# EAGLE design LaunchPad_CarrierV2 (EAGLE 7.1.0)
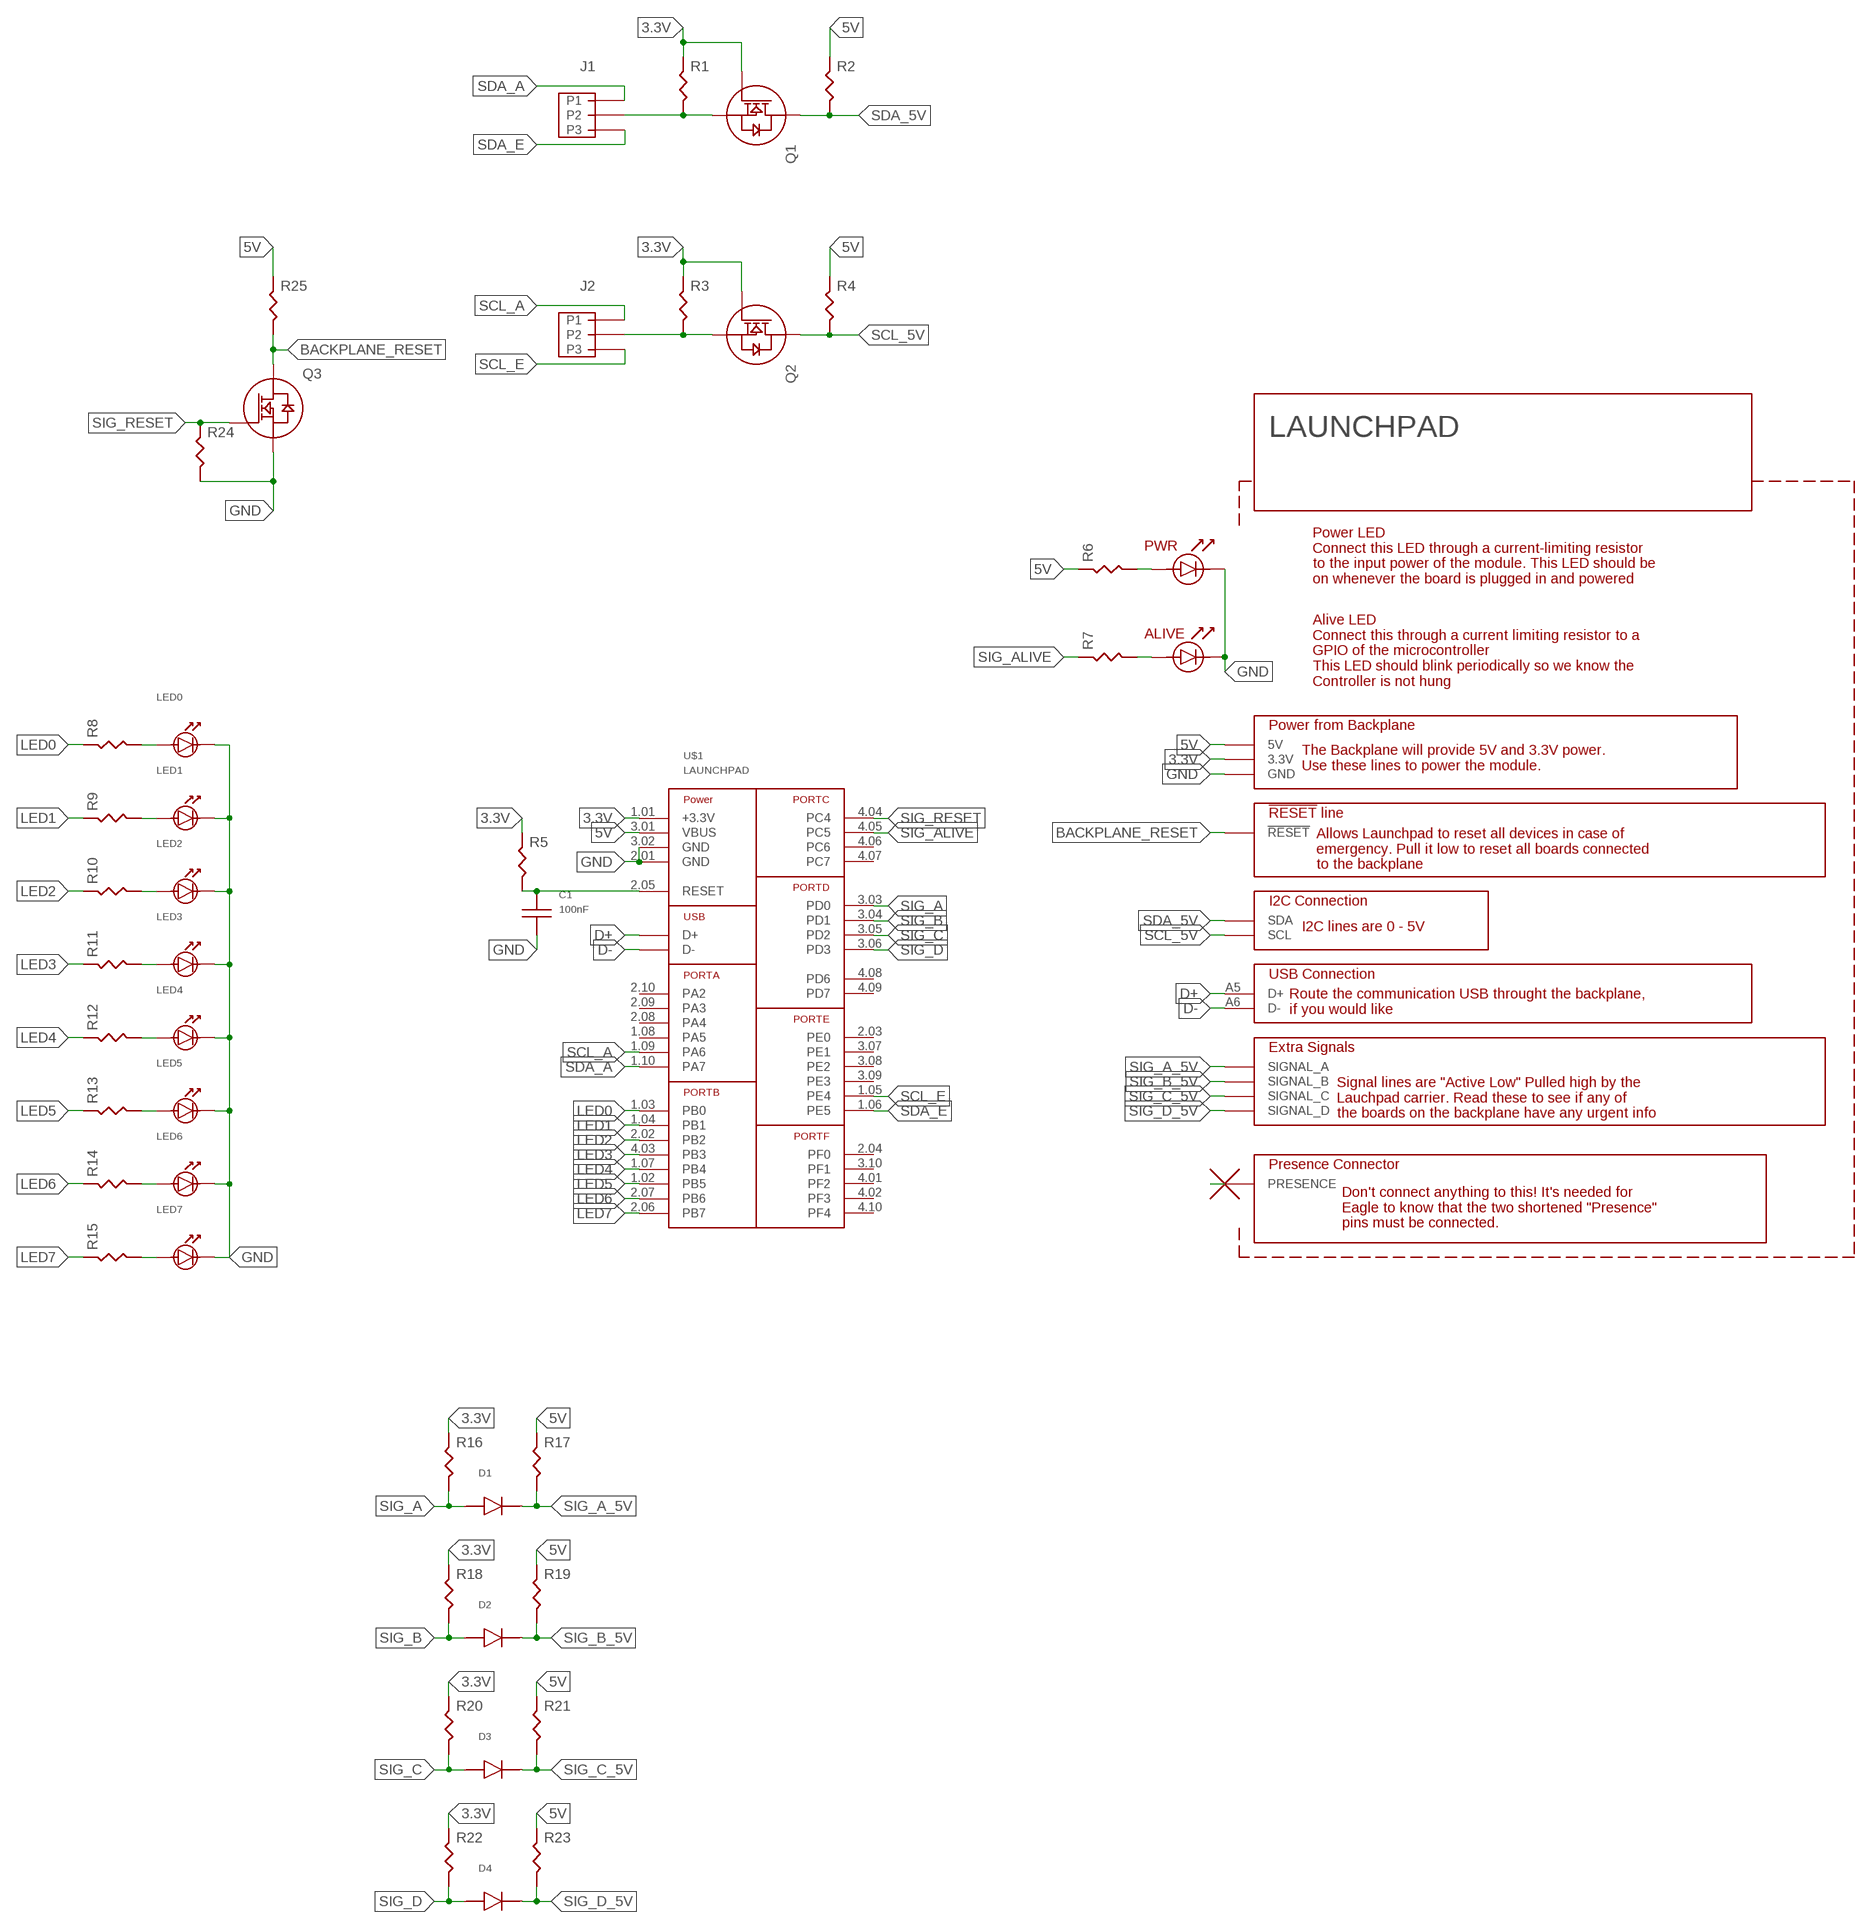
[diagram p0: schematic, sheet 1]

## Parts
C1  100nF  CAPACITOR-UNPOLARIZED0805  [0805_STACKPOLERESISTOR]
D1  DIODESOD-123FL  [SOD-123FL]
D2  DIODESOD-123FL  [SOD-123FL]
D3  DIODESOD-123FL  [SOD-123FL]
D4  DIODESOD-123FL  [SOD-123FL]
J1  3PIN_HEADER  [3PIN_HEADER]
J2  3PIN_HEADER  [3PIN_HEADER]
LAUNCHPAD  LAUNCHPAD_CARRIERCARD  [SUBSYSTEM2016_V2-LAUNCHPADCARRIER]
LED0  LED  [0805_LED]
LED1  LED  [0805_LED]
LED2  LED  [0805_LED]
LED3  LED  [0805_LED]
LED4  LED  [0805_LED]
LED5  LED  [0805_LED]
LED6  LED  [0805_LED]
LED7  LED  [0805_LED]
Q1  NMOSSOT-23  [SOT-23]
Q2  NMOSSOT-23  [SOT-23]
Q3  NMOSSOT-23  [SOT-23]
R1  RESISTOR  [0805_STACKPOLERESISTOR]
R2  RESISTOR  [0805_STACKPOLERESISTOR]
R3  RESISTOR  [0805_STACKPOLERESISTOR]
R4  RESISTOR  [0805_STACKPOLERESISTOR]
R5  RESISTOR  [0805_STACKPOLERESISTOR]
R6  RESISTOR  [0805_STACKPOLERESISTOR]
R7  RESISTOR  [0805_STACKPOLERESISTOR]
R8  RESISTOR  [0805_STACKPOLERESISTOR]
R9  RESISTOR  [0805_STACKPOLERESISTOR]
R10  RESISTOR  [0805_STACKPOLERESISTOR]
R11  RESISTOR  [0805_STACKPOLERESISTOR]
R12  RESISTOR  [0805_STACKPOLERESISTOR]
R13  RESISTOR  [0805_STACKPOLERESISTOR]
R14  RESISTOR  [0805_STACKPOLERESISTOR]
R15  RESISTOR  [0805_STACKPOLERESISTOR]
R16  RESISTOR  [0805_STACKPOLERESISTOR]
R17  RESISTOR  [0805_STACKPOLERESISTOR]
R18  RESISTOR  [0805_STACKPOLERESISTOR]
R19  RESISTOR  [0805_STACKPOLERESISTOR]
R20  RESISTOR  [0805_STACKPOLERESISTOR]
R21  RESISTOR  [0805_STACKPOLERESISTOR]
R22  RESISTOR  [0805_STACKPOLERESISTOR]
R23  RESISTOR  [0805_STACKPOLERESISTOR]
R24  RESISTOR  [0805_STACKPOLERESISTOR]
R25  RESISTOR  [0805_STACKPOLERESISTOR]
U$1  LAUNCHPAD  [LAUNCHPAD]

## Nets
3.3V: LAUNCHPAD.A3(3.3V) LAUNCHPAD.A4(3.3V) Q1.G(GATE) Q2.G(GATE) R1.P$1 R3.P$1 R5.P$1 R16.P$1 R18.P$1 R20.P$1 R22.P$1 U$1.1.01(+3.3V)
5V: LAUNCHPAD.B2(5V) LAUNCHPAD.B3(5V) R2.P$1 R4.P$1 R6.P$1 R17.P$1 R19.P$1 R21.P$1 R23.P$1 R25.P$1 U$1.3.01(VBUS)
BACKPLANE_RESET: LAUNCHPAD.B5(!RESET) LAUNCHPAD.B6(!RESET) Q3.D(DRAIN) R25.P$2
D+: LAUNCHPAD.A5(D+) U$1.USB_D+(D+)
D-: LAUNCHPAD.A6(D-) U$1.USB_D-(D-)
GND: C1.P$2 LAUNCHPAD.A7(GND) LAUNCHPAD.A8(GND) LAUNCHPAD.A9(GND) LAUNCHPAD.A10(GND) LAUNCHPAD.ALIVELED_CATHODE LAUNCHPAD.PWRLED_CATHODE LED0.CATHODE LED1.CATHODE LED2.CATHODE LED3.CATHODE LED4.CATHODE LED5.CATHODE LED6.CATHODE LED7.CATHODE Q3.S(SOURCE) R24.P$2 U$1.2.01(GND) U$1.3.02(GND)
LED0: R8.P$1 U$1.1.03(PB0)
LED1: R9.P$1 U$1.1.04(PB1)
LED2: R10.P$1 U$1.2.02(PB2)
LED3: R11.P$1 U$1.4.03(PB3)
LED4: R12.P$1 U$1.1.07(PB4)
LED5: R13.P$1 U$1.1.02(PB5)
LED6: R14.P$1 U$1.2.07(PB6)
LED7: R15.P$1 U$1.2.06(PB7)
N$1: LED0.ANODE R8.P$2
N$2: LAUNCHPAD.A2(PRESENCE) LAUNCHPAD.B17(PRESENCE)
N$3: C1.P$1 R5.P$2 U$1.2.05(RESET)
N$5: LED1.ANODE R9.P$2
N$6: LED2.ANODE R10.P$2
N$7: LED3.ANODE R11.P$2
N$8: LED4.ANODE R12.P$2
N$9: LED5.ANODE R13.P$2
N$10: LED6.ANODE R14.P$2
N$11: LED7.ANODE R15.P$2
N$18: LAUNCHPAD.PWRLED_ANODE R6.P$2
N$19: LAUNCHPAD.ALIVELED_ANODE R7.P$2
SCL_3.3V: J2.P2 Q2.S(SOURCE) R3.P$2
SCL_5V: LAUNCHPAD.B9(SCL) LAUNCHPAD.B10(SCL) Q2.D(DRAIN) R4.P$2
SCL_A: J2.P1 U$1.1.09(PA6)
SCL_E: J2.P3 U$1.1.05(PE4)
SDA_3.3V: J1.P2 Q1.S(SOURCE) R1.P$2
SDA_5V: LAUNCHPAD.B7(SDA) LAUNCHPAD.B8(SDA) Q1.D(DRAIN) R2.P$2
SDA_A: J1.P1 U$1.1.10(PA7)
SDA_E: J1.P3 U$1.1.06(PE5)
SIG_A: D1.ANODE R16.P$2 U$1.3.03(PD0)
SIG_A_5V: D1.CATHODE LAUNCHPAD.B13(SIGNAL_A) LAUNCHPAD.B14(SIGNAL_A) R17.P$2
SIG_ALIVE: R7.P$1 U$1.4.05(PC5)
SIG_B: D2.ANODE R18.P$2 U$1.3.04(PD1)
SIG_B_5V: D2.CATHODE LAUNCHPAD.B15(SIGNAL_B) LAUNCHPAD.B16(SIGNAL_B) R19.P$2
SIG_C: D3.ANODE R20.P$2 U$1.3.05(PD2)
SIG_C_5V: D3.CATHODE LAUNCHPAD.A13(SIGNAL_C) LAUNCHPAD.A14(SIGNAL_C) R21.P$2
SIG_D: D4.ANODE R22.P$2 U$1.3.06(PD3)
SIG_D_5V: D4.CATHODE LAUNCHPAD.A15(SIGNAL_D) LAUNCHPAD.A16(SIGNAL_D) R23.P$2
SIG_RESET: Q3.G(GATE) R24.P$1 U$1.4.04(PC4)
Unconnected: U$1.1.08(PA5) U$1.2.03(PE0) U$1.2.04(PF0) U$1.2.08(PA4) U$1.2.09(PA3) U$1.2.10(PA2) U$1.3.07(PE1) U$1.3.08(PE2) U$1.3.09(PE3) U$1.3.10(PF1) U$1.4.01(PF2) U$1.4.02(PF3) U$1.4.06(PC6) U$1.4.07(PC7) U$1.4.08(PD6) U$1.4.09(PD7) U$1.4.10(PF4)

## Library data of the parts
C1 = 000_CustomPartsMaster:CAPACITOR-UNPOLARIZED
D1-D4 = 000_CustomPartsMaster:DIODE
J1 J2 = 000_CustomPartsMaster:3PIN_HEADER
LAUNCHPAD = 000_CustomPartsMaster:LAUNCHPAD_CARRIERCARD
LED0 LED1-LED7 = 000_CustomPartsMaster:LED
Q1-Q3 = 000_CustomPartsMaster:NMOS
R1-R25 = 000_CustomPartsMaster:RESISTOR
U$1 = 000_CustomPartsMaster:LAUNCHPAD

## Board
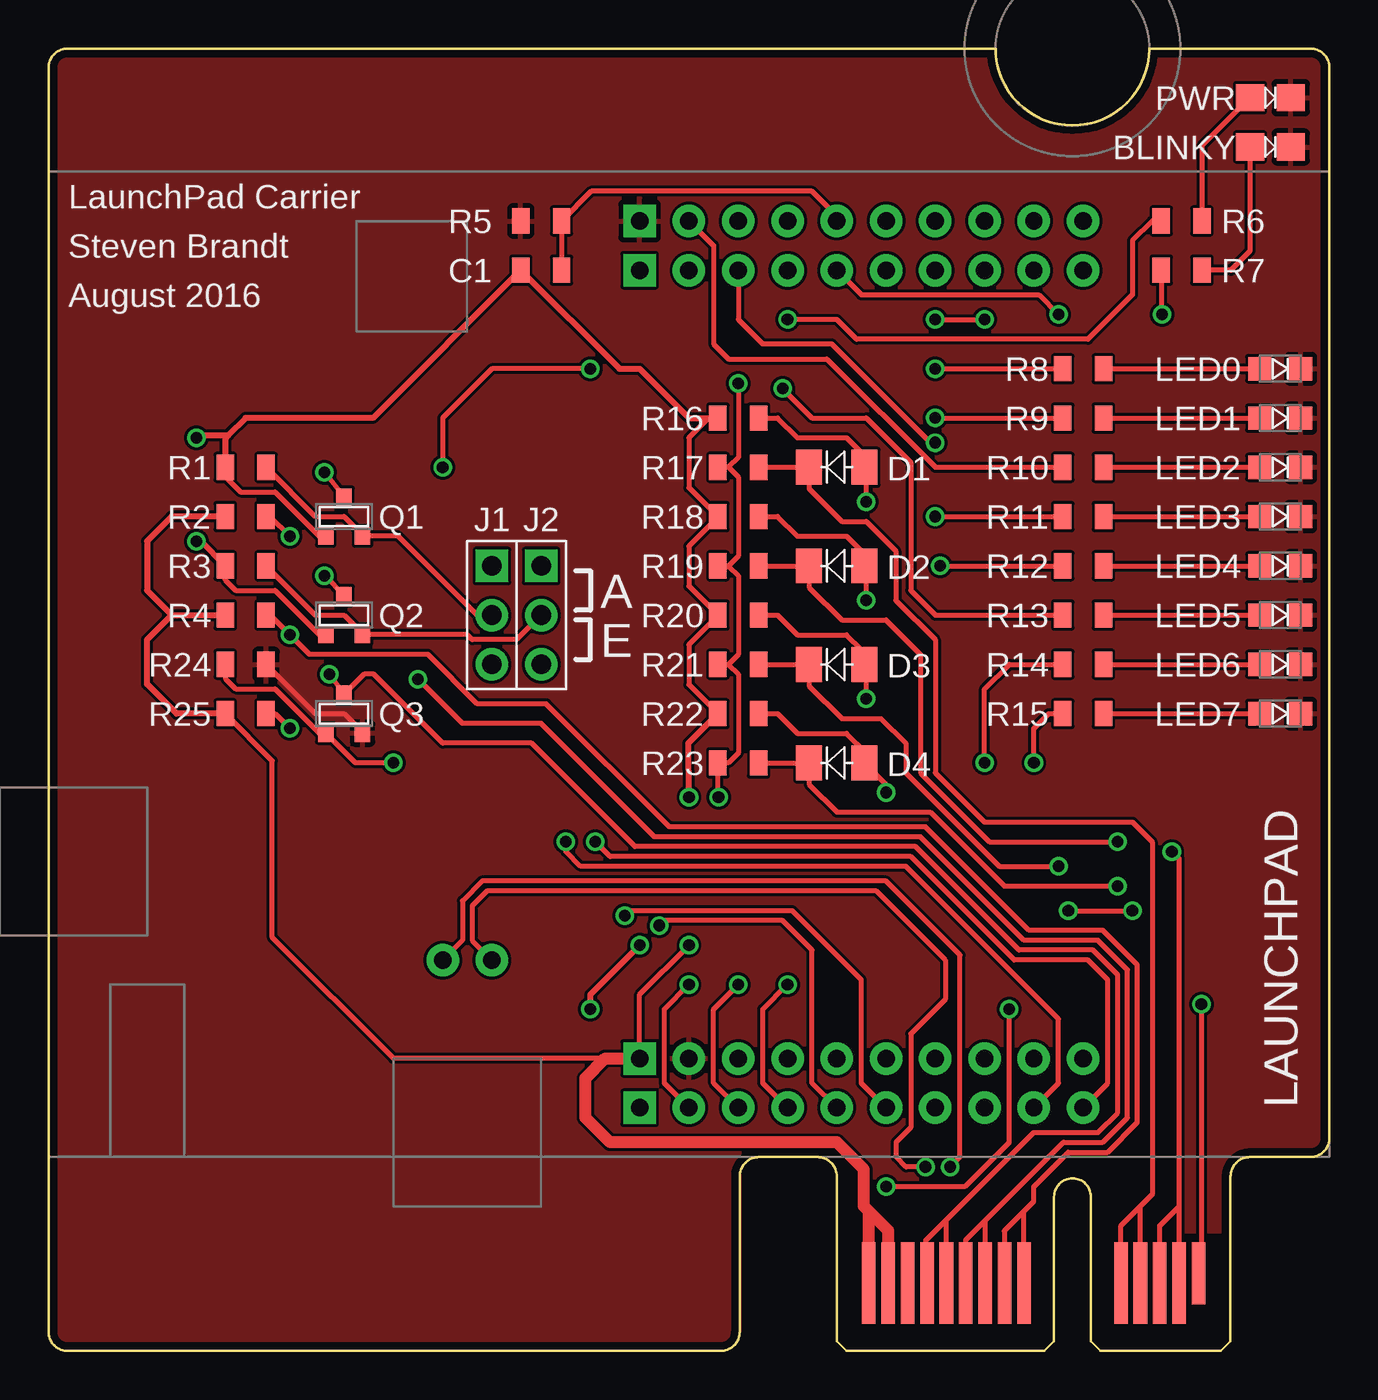
[diagram p1: board, top side]
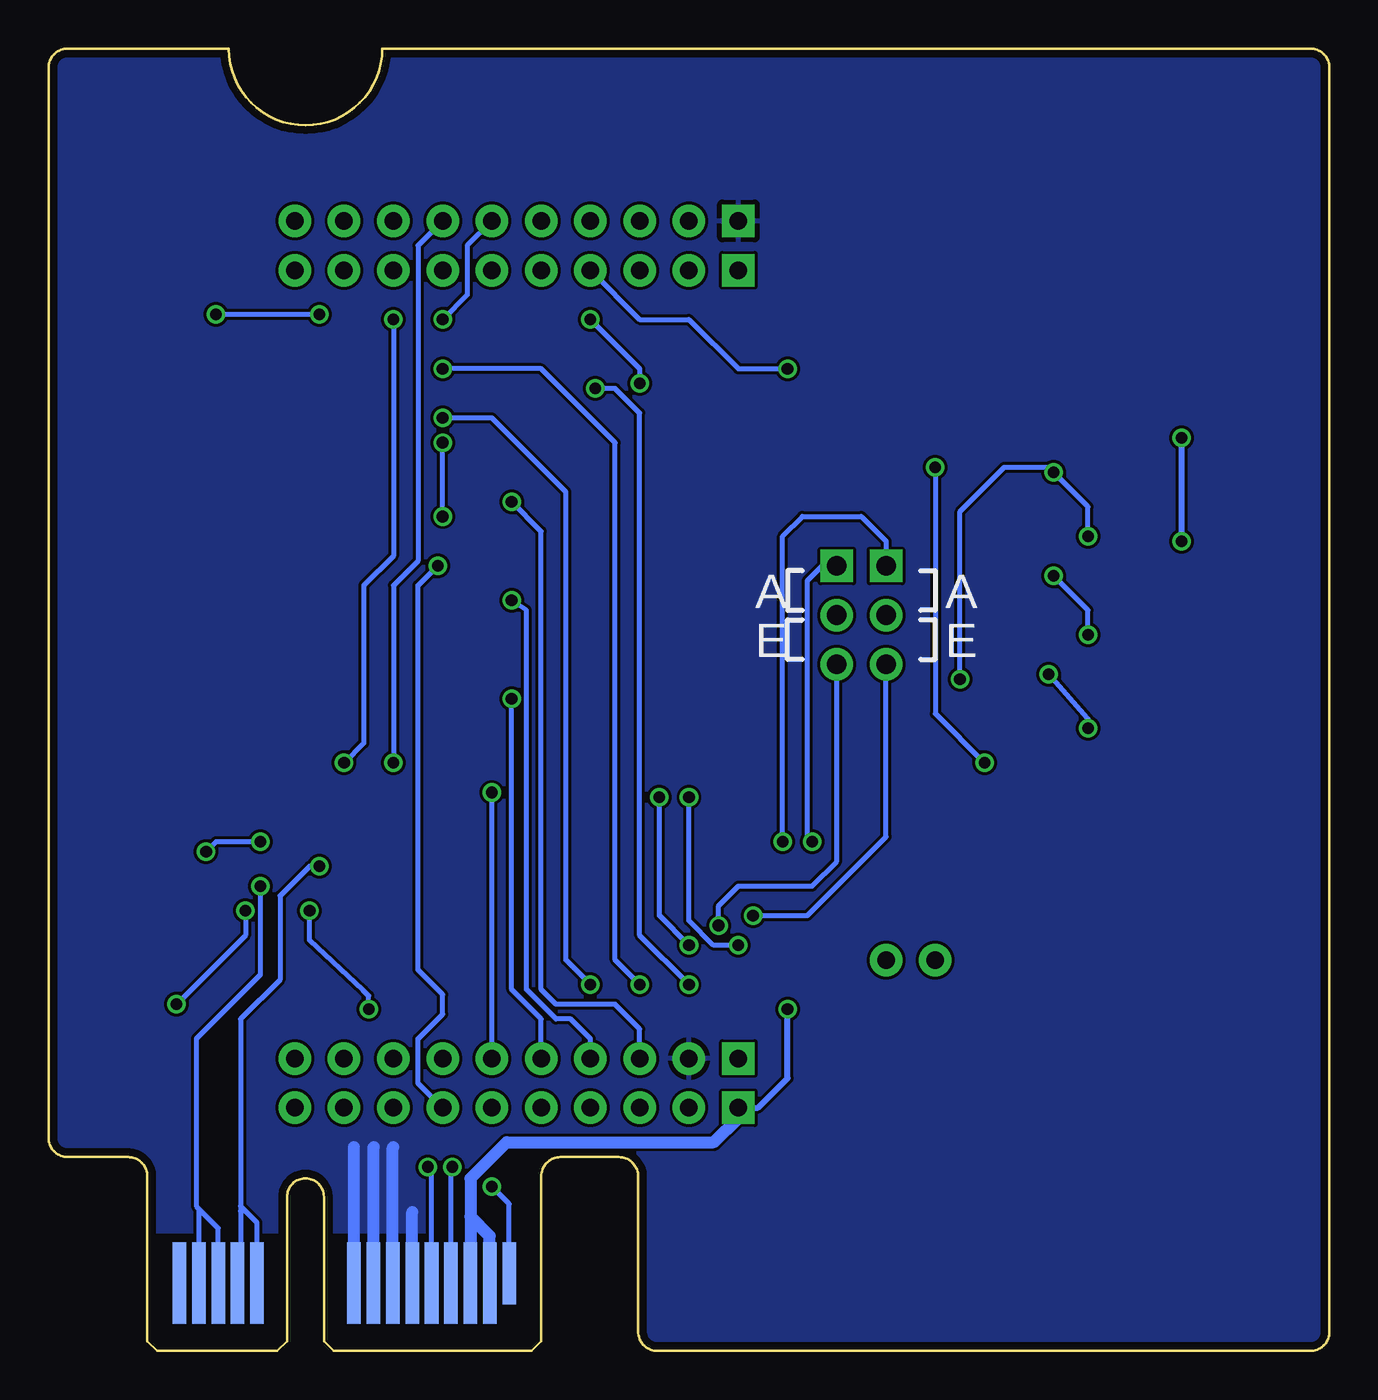
[diagram p2: board, bottom side, seen from below]

Size 66.04 x 67.15 mm. Coordinates in mm from the lower left corner, seen from the top.
Copper layers (1*16): Top 0.0356mm / dielectric 1.5011mm / Bottom 0.0356mm
Design rules "oshpark-2layer": minimum track width 6mil, minimum drill 13mil, track to track 6mil, track to pad 6mil, pad to pad 6mil, via to via 6mil, smd to smd 6mil, copper to edge 15mil, drill to drill 6mil, minimum pad ring 7mil, minimum via ring 7mil, stop-mask expansion 4mil, vias tented up to drill 0mil, thermal gap 10mil

### Footprints (pad centres in the part's own frame; a part is rotated, then mirrored left to right if it is on the bottom)
0805_STACKPOLERESISTOR = smd 0.9 x 1.3: P$1 -1.05,0; P$2 1.05,0
SOD-123FL = smd 1.34 x 1.8: ANODE 1.43,0; CATHODE -1.43,0
3PIN_HEADER = drill 1.016 pad 1.676 square: P1 0,2.54 | drill 1.016 pad 1.676: P2 0,0; P3 0,-2.54
SUBSYSTEM2016_V2-LAUNCHPADCARRIER = smd 0.7 x 3.2 bottom: A2 42.29,4.16 | smd 0.7 x 4.2 bottom: A3 43.29,3.66; A4 44.29,3.66; A5 45.29,3.66; A6 46.29,3.66; A7 47.29,3.66; A8 48.29,3.66; A9 49.29,3.66; A10 50.29,3.66; A13 55.29,3.66; A14 56.29,3.66; A15 57.29,3.66; A16 58.29,3.66; A17 59.29,3.66 | smd 1.45 x 1.4: ALIVELED_ANODE 61.942,62.23; ALIVELED_CATHODE 64.042,62.23; PWRLED_ANODE 61.942,64.77; PWRLED_CATHODE 64.042,64.77 | smd 0.7 x 4.2: B2 42.29,3.66; B3 43.29,3.66; B4 44.29,3.66; B5 45.29,3.66; B6 46.29,3.66; B7 47.29,3.66; B8 48.29,3.66; B9 49.29,3.66; B10 50.29,3.66; B13 55.29,3.66; B14 56.29,3.66; B15 57.29,3.66; B16 58.29,3.66 | smd 0.7 x 3.2: B17 59.29,4.16
0805_LED = smd 1.2 x 1.2: ANODE -1.05,0; CATHODE 1.05,0
SOT-23 = smd 0.8 x 0.9: D 0,1; G -0.95,-1; S 0.95,-1
LAUNCHPAD = drill 0.9 pad 1.676 square: 1.01 2.54,35.56; 2.01 48.26,35.56; 3.01 5.08,35.56; 4.01 45.72,35.56 | drill 0.9 pad 1.676: 1.02 2.54,33.02; 1.03 2.54,30.48; 1.04 2.54,27.94; 1.05 2.54,25.4; 1.06 2.54,22.86; 1.07 2.54,20.32; 1.08 2.54,17.78; 1.09 2.54,15.24; 1.10 2.54,12.7; 2.02 48.26,33.02; 2.03 48.26,30.48; 2.04 48.26,27.94; 2.05 48.26,25.4; 2.06 48.26,22.86; 2.07 48.26,20.32; 2.08 48.26,17.78; 2.09 48.26,15.24; 2.10 48.26,12.7; 3.02 5.08,33.02; 3.03 5.08,30.48; 3.04 5.08,27.94; 3.05 5.08,25.4; 3.06 5.08,22.86; 3.07 5.08,20.32; 3.08 5.08,17.78; 3.09 5.08,15.24; 3.10 5.08,12.7; 4.02 45.72,33.02; 4.03 45.72,30.48; 4.04 45.72,27.94; 4.05 45.72,25.4; 4.06 45.72,22.86; 4.07 45.72,20.32; 4.08 45.72,17.78; 4.09 45.72,15.24; 4.10 45.72,12.7; USB_D+ 10.16,43.18; USB_D- 10.16,45.72

### Placement (x,y rotation side)
C1  25.4,58.26 180 top
D1  40.64,45.56 0 top
D2  40.64,40.48 0 top
D3  40.64,35.4 0 top
D4  40.64,30.32 0 top
J1  22.86,37.94 0 top
J2  25.4,37.94 0 top
LAUNCHPAD  0,-0.16 0 top
LED0  63.5,50.64 0 top
LED1  63.5,48.1 0 top
LED2  63.5,45.56 0 top
LED3  63.5,43.02 0 top
LED4  63.5,40.48 0 top
LED5  63.5,37.94 0 top
LED6  63.5,35.4 0 top
LED7  63.5,32.86 0 top
Q1  15.24,43.02 0 top
Q2  15.24,37.94 0 top
Q3  15.24,32.86 0 top
R1  10.16,45.56 0 top
R2  10.16,43.02 0 top
R3  10.16,40.48 0 top
R4  10.16,37.94 0 top
R5  25.4,55.72 0 top
R6  58.42,58.26 0 top
R7  58.42,55.72 0 top
R8  53.34,50.64 0 top
R9  53.34,48.1 0 top
R10  53.34,45.56 0 top
R11  53.34,43.02 0 top
R12  53.34,40.48 0 top
R13  53.34,37.94 0 top
R14  53.34,35.4 0 top
R15  53.34,32.86 0 top
R16  35.56,48.1 0 top
R17  35.56,45.56 0 top
R18  35.56,43.02 0 top
R19  35.56,40.48 0 top
R20  35.56,37.94 0 top
R21  35.56,35.4 0 top
R22  35.56,32.86 0 top
R23  35.56,30.32 0 top
R24  10.16,35.4 0 top
R25  10.16,32.86 0 top
U$1  66.04,10 90 top

### Tracks (layer width: path | path; a pad name or v marks a point on that pad's centre or on a via)
3.3V  (via drill 0.6)
  Top 0.254: R1.P$1 9.11,45.09 9.91,44.29 11.68,44.29 13.95,42.02 Q1.G | Q2.G 13.95,36.94 11.68,39.21 9.65,39.21 9.11,39.75 R3.P$1 | R16.P$1 34.04,48.1 33.02,47.08 33.02,44.51 R18.P$1 34.51,42.99 33.02,41.5 33.02,39.43 R20.P$1 34.51,37.91 33.02,36.42 33.02,34.35 R22.P$1
  Top 0.305: v27.94,17.62 27.94,18.38 v30.48,20.92 | v33.02,28.54 32.99,31.34 R22.P$1 | R16.P$1 33.02,48.1 30.48,50.64 29.43,50.64 R5.P$1 16.73,48.1 10.16,48.1 9.27,47.21 | 9.27,47.21 9.11,47.05 R1.P$1 | R3.P$1 7.84,41.75 v7.62,41.75 | v7.62,47.08 7.75,47.21 9.27,47.21
  Bottom 0.254: v30.48,20.92 31.75,20.92 33.02,22.19 v33.02,28.54
  Bottom 0.305: U$1.1.01 29.46,12.54 27.94,14.06 v27.94,17.62 | v7.62,41.75 v7.62,47.08
  Bottom 0.61: LAUNCHPAD.A3 43.29,5.94 44.29,6.94 | U$1.1.01 30.48,12.03 31.75,10.76 42.42,10.76 44.29,8.89 44.29,6.94 | 44.29,6.94 LAUNCHPAD.A4
5V  (via drill 0.6)
  Top 0.254: R6.P$1 56.9,58.26 55.88,57.24 55.88,54.45 53.59,52.16 41.66,52.16 40.64,53.18 v38.1,53.18 | 35.05,45.56 35.56,45.05 35.56,40.99 35.05,40.48 R19.P$1 34.54,40.45 35.09,40.45 35.56,39.97 35.56,35.91 35.05,35.4 | R21.P$1 35.05,35.4 | 35.05,35.4 35.56,34.89 35.56,30.83 35.05,30.32 R23.P$1 34.51,28.58 v34.54,28.54 | v35.56,49.88 35.56,46.07 35.05,45.56 | 35.05,45.56 R17.P$1 | R25.P$1 11.54,30.43 11.54,21.32 17.78,15.08 U$1.3.01 30.48,18.38 v33.02,20.92
  Top 0.305: R2.P$1 6.35,43.02 5.08,41.75 5.08,39.21 6.35,37.94 | 6.35,37.94 R4.P$1 | R25.P$1 6.6,32.86 5.08,34.38 5.08,36.67 6.35,37.94
  Top 0.61: U$1.3.01 28.7,15.08 27.69,14.06 27.69,12.03 28.96,10.76 40.64,10.76 42.04,9.37 42.04,7.46 42.29,7.21 | LAUNCHPAD.B3 43.29,6.21 42.29,7.21 | LAUNCHPAD.B2 42.29,7.21
  Bottom 0.254: v38.1,53.18 35.56,50.64 v35.56,49.88 | v33.02,20.92 34.54,22.45 v34.54,28.54
BACKPLANE_RESET  (via drill 0.6)
  Top 0.254: 46.23,3.14 46.23,3.44 LAUNCHPAD.B6 46.29,6.76 | R25.P$2 11.68,32.86 v12.45,32.1 | v14.48,34.89 Q3.D 16.27,34.89 16.76,34.89 20.32,31.34 24.89,31.34 30.23,26 44.7,26 50.04,20.67 53.85,20.67 55.12,19.4 55.12,12.29 54.1,11.27 50.8,11.27 46.29,6.76 | 46.29,6.76 45.21,5.68 45.21,2.89 | LAUNCHPAD.B5 45.29,3.22 45.21,3.14
  Bottom 0.254: v12.45,32.1 12.45,32.61 v14.48,34.89
D+  (via drill 0.6)
  Top 0.254: U$1.USB_D+ 21.84,21.18 21.84,22.95 22.61,23.72 42.67,23.72 46.23,20.16 46.23,18.13 44.45,16.35 44.45,11.52 43.7,10.78 43.7,10 44.21,9.49 v45.21,9.49
  Bottom 0.254: LAUNCHPAD.A5 45.29,9.41 v45.21,9.49
D-  (via drill 0.6)
  Top 0.254: v46.48,9.49 46.99,10 46.99,20.41 43.18,24.22 22.35,24.22 21.34,23.21 21.34,21.18 U$1.USB_D-
  Bottom 0.254: LAUNCHPAD.A6 46.29,9.3 v46.48,9.49
GND
  Top 0.254: R24.P$2 13.75,32.86 15.24,32.86 16.19,31.91 Q3.S
  Bottom 0.61: LAUNCHPAD.A7 47.29,7.16 | LAUNCHPAD.A8 48.29,10.48 48.26,10.51 | LAUNCHPAD.A9 49.29,10.49 49.28,10.51 | LAUNCHPAD.A10 50.29,10.51
  pour Top: -2.54,70.96 68.58,70.96 68.58,-2.7 -2.54,-2.7
  pour Bottom: -5.08,73.5 71.12,73.5 71.12,-5.24 -5.08,-5.24
LED0  (via drill 0.6)
  Top 0.254: v45.72,50.64 R8.P$1 | U$1.1.03 34.29,13.81 34.29,17.62 v35.56,18.89
  Bottom 0.254: v45.72,50.64 40.64,50.64 36.83,46.83 36.83,20.16 v35.56,18.89
LED1  (via drill 0.6)
  Top 0.254: v45.72,48.1 R9.P$1 | U$1.1.04 36.83,13.81 36.83,17.62 v38.1,18.89
  Bottom 0.254: v45.72,48.1 43.18,48.1 39.37,44.29 39.37,20.16 v38.1,18.89
LED2
  Top 0.254: U$1.2.02 34.29,56.99 34.29,51.91 35.05,51.15 40.13,51.15 45.72,45.56 R10.P$1
LED3  (via drill 0.6)
  Top 0.254: U$1.4.03 35.56,53.18 36.83,51.91 40.39,51.91 45.47,46.83 v45.72,46.83 | v45.72,43.02 R11.P$1
  Bottom 0.254: v45.72,43.02 v45.72,46.83
LED4  (via drill 0.6)
  Top 0.254: v45.97,40.48 R12.P$1
  Bottom 0.254: U$1.1.07 46.99,13.81 46.99,16.1 45.72,17.37 45.72,18.38 46.99,19.65 46.99,39.46 v45.97,40.48
LED5  (via drill 0.6)
  Top 0.254: v37.85,49.62 39.37,48.1 42.16,48.1 44.45,45.81 44.45,39.21 45.72,37.94 R13.P$1 | U$1.1.02 31.75,13.81 31.75,17.62 v33.02,18.89
  Bottom 0.254: v37.85,49.62 36.83,49.62 35.56,48.35 35.56,21.43 v33.02,18.89
LED6  (via drill 0.6)
  Top 0.254: v48.26,30.32 48.26,34.13 49.53,35.4 R14.P$1
  Bottom 0.254: U$1.2.07 46.99,56.99 46.99,40.73 48.26,39.46 v48.26,30.32
LED7  (via drill 0.6)
  Top 0.254: v45.72,53.18 v48.26,53.18 | v50.8,30.32 50.8,32.1 51.56,32.86 R15.P$1
  Bottom 0.254: U$1.2.06 44.45,56.99 44.45,54.45 v45.72,53.18 | v48.26,53.18 48.26,40.99 49.78,39.46 49.78,31.34 v50.8,30.32
N$1
  Top 0.254: R8.P$2 LED0.ANODE
N$2  (via drill 0.6)
  Top 0.254: v52.58,22.7 v55.88,22.7 | v59.44,17.87 59.44,4.15 LAUNCHPAD.B17 | v49.53,17.62 49.53,10.76 47.24,8.48 v43.18,8.48
  Bottom 0.254: LAUNCHPAD.A2 42.29,7.59 v43.18,8.48 | v52.58,22.7 52.58,21.18 49.82,18.6 49.53,18.31 v49.53,17.62 | v55.88,22.7 55.88,21.43 v59.44,17.87
N$3
  Top 0.254: U$1.2.05 40.64,58.51 39.37,59.78 27.97,59.78 C1.P$1 R5.P$2
N$5
  Top 0.254: R9.P$2 LED1.ANODE
N$6
  Top 0.254: R10.P$2 LED2.ANODE
N$7
  Top 0.254: R11.P$2 LED3.ANODE
N$8
  Top 0.254: R12.P$2 LED4.ANODE
N$9
  Top 0.254: R13.P$2 LED5.ANODE
N$10
  Top 0.254: R14.P$2 LED6.ANODE
N$11
  Top 0.254: R15.P$2 LED7.ANODE
N$18
  Top 0.254: LAUNCHPAD.PWRLED_ANODE 59.47,62.14 R6.P$2
N$19
  Top 0.254: LAUNCHPAD.ALIVELED_ANODE 61.94,56.7 60.96,55.72 R7.P$2
SCL_3.3V
  Top 0.254: R3.P$2 13.75,37.94 15.24,37.94 16.19,36.99 Q2.S 21.57,36.94 21.84,36.67 24.13,36.67 J2.P2
SCL_5V  (via drill 0.6)
  Top 0.254: R4.P$2 11.43,37.94 v12.45,36.92 13.46,35.91 19.56,35.91 22.1,33.37 25.65,33.37 32,27.02 45.21,27.02 50.55,21.68 54.36,21.68 56.13,19.91 56.13,11.78 54.61,10.25 52.58,10.25 50.8,8.48 50.8,7.71 50.29,7.2 | v14.22,39.97 Q2.D | 50.29,7.2 49.28,6.19 49.28,3.51 LAUNCHPAD.B9 | LAUNCHPAD.B10 50.29,7.2
  Bottom 0.254: v12.45,36.92 12.45,38.19 v14.22,39.97
SCL_A  (via drill 0.6)
  Top 0.254: U$1.1.09 52.07,13.81 52.07,17.11 44.2,24.99 27.43,24.99 26.67,25.75 v26.67,26.26
  Bottom 0.254: v26.67,26.26 26.92,26.51 26.92,39.72 26.16,40.48 J2.P1
SCL_E  (via drill 0.6)
  Top 0.254: U$1.1.05 39.37,13.81 39.37,20.67 37.85,22.19 31.75,22.19 v31.5,21.94
  Bottom 0.254: v31.5,21.94 31.5,22.95 30.48,23.97 26.67,23.97 25.4,25.24 J2.P3
SDA_3.3V
  Top 0.254: R1.P$2 13.75,43.02 15.24,43.02 16.19,42.07 Q1.S 18.02,42.02 22.1,37.94 J1.P2
SDA_5V  (via drill 0.6)
  Top 0.254: R2.P$2 11.43,43.02 v12.45,42 | v14.22,45.31 Q1.D | v19.05,34.64 21.34,32.35 25.4,32.35 31.24,26.51 44.96,26.51 50.29,21.18 54.1,21.18 55.63,19.65 55.63,12.03 54.36,10.76 52.32,10.76 48.29,6.73 | LAUNCHPAD.B8 48.29,6.73 | LAUNCHPAD.B7 47.29,5.73 48.29,6.73
  Bottom 0.254: v12.45,42 12.45,43.53 v14.22,45.31 14.48,45.56 16.76,45.56 19.05,43.27 v19.05,34.64
SDA_A  (via drill 0.6)
  Top 0.254: U$1.1.10 54.61,13.81 54.61,19.14 53.59,20.16 49.78,20.16 44.45,25.49 28.96,25.49 v28.19,26.26
  Bottom 0.254: v28.19,26.26 28.19,42 27.18,43.02 24.13,43.02 22.86,41.75 J1.P1
SDA_E  (via drill 0.6)
  Top 0.254: U$1.1.06 41.91,13.81 41.91,19.14 38.35,22.7 29.97,22.7 v29.72,22.45
  Bottom 0.254: v29.72,22.45 26.92,22.45 22.86,26.51 J1.P3
SIG_A  (via drill 0.6)
  Top 0.254: R16.P$2 37.59,48.1 38.61,47.08 41.15,47.08 42.16,46.07 42.16,45.65 D1.ANODE 42.16,45.47 v42.16,43.78
  Bottom 0.254: U$1.3.03 35.56,16.6 36.83,17.87 39.88,17.87 40.64,18.64 40.64,42.26 v42.16,43.78
SIG_A_5V
  Top 0.254: LAUNCHPAD.B14 56.29,7.46 | LAUNCHPAD.B13 55.29,6.46 56.29,7.46 | R17.P$2 D1.CATHODE 39.21,44.45 40.89,42.77 42.16,42.77 43.69,41.24 43.69,38.7 45.72,36.67 45.72,29.81 48.26,27.27 55.88,27.27 56.9,26.26 56.9,8.07 56.29,7.46
SIG_ALIVE  (via drill 0.6)
  Top 0.254: U$1.4.05 41.91,54.45 51.05,54.45 v52.07,53.43 | v57.4,53.43 57.4,55.69 R7.P$1
  Bottom 0.254: v52.07,53.43 v57.4,53.43
SIG_B  (via drill 0.6)
  Top 0.254: R18.P$2 37.59,43.02 38.61,42 41.15,42 41.91,41.24 41.91,40.64 D2.ANODE 42.16,40.39 v42.16,38.7
  Bottom 0.254: U$1.3.04 38.1,16.1 39.12,17.11 39.88,17.11 41.4,18.64 41.4,38.19 v42.16,38.7
SIG_B_5V  (via drill 0.6)
  Top 0.254: LAUNCHPAD.B16 58.29,7.46 | 58.29,7.46 58.29,25.37 v57.91,25.75 | LAUNCHPAD.B15 57.29,6.46 58.29,7.46 | v55.12,26.26 48.51,26.26 44.96,29.81 44.96,35.91 43.18,37.69 40.89,37.69 39.21,39.37 D2.CATHODE R19.P$2
  Bottom 0.254: v55.12,26.26 57.4,26.26 v57.91,25.75
SIG_C  (via drill 0.6)
  Top 0.254: R20.P$2 37.59,37.94 38.61,36.92 41.15,36.92 41.91,36.16 41.91,35.56 D3.ANODE 42.16,35.31 v42.16,33.62
  Bottom 0.254: U$1.3.05 40.64,17.11 42.16,18.64 v42.16,33.62
SIG_C_5V  (via drill 0.6)
  Top 0.254: v52.07,24.99 49.02,24.99 44.2,29.81 44.2,31.34 42.93,32.61 40.89,32.61 39.21,34.29 D3.CATHODE R21.P$2
  Bottom 0.254: 56.13,7.46 56.13,7.21 56.13,3.66 LAUNCHPAD.A14 | LAUNCHPAD.A13 55.29,6.62 56.13,7.46 | v52.07,24.99 52.58,24.99 54.1,23.46 54.1,19.14 56.13,17.11 56.13,7.46
SIG_D  (via drill 0.6)
  Top 0.254: R22.P$2 37.59,32.86 38.61,31.84 41.15,31.84 42.16,30.83 42.16,30.41 D4.ANODE 43.18,29.21 v43.18,28.8
  Bottom 0.254: U$1.3.06 v43.18,28.8
SIG_D_5V  (via drill 0.6)
  Top 0.254: v55.12,23.97 49.28,23.97 45.47,27.78 40.64,27.78 39.21,29.21 D4.CATHODE R23.P$2
  Bottom 0.254: 58.29,7.33 58.42,7.46 58.42,16.1 55.12,19.4 v55.12,23.97 | 58.29,7.33 LAUNCHPAD.A16 | LAUNCHPAD.A15 57.29,6.33 58.29,7.33
SIG_RESET  (via drill 0.6)
  Top 0.254: R24.P$1 9.11,34.67 9.65,34.13 11.68,34.13 13.95,31.86 Q3.G 15.83,30.32 v17.78,30.32 | v27.94,50.64 22.86,50.64 20.32,48.1 v20.32,45.56
  Bottom 0.254: U$1.4.04 35.56,53.18 33.02,53.18 30.48,50.64 v27.94,50.64 | v20.32,45.56 20.32,32.86 v17.78,30.32

### Text on the board
tPlace: LaunchPad Carrier | Steven Brandt | August 2016 | A | E
bNames: A | A | E | E